# Altium schematic sheet BufferDriver.SchDoc
size A4; DocumentNumber: 3; SheetNumber: 3; SheetTotal: 6
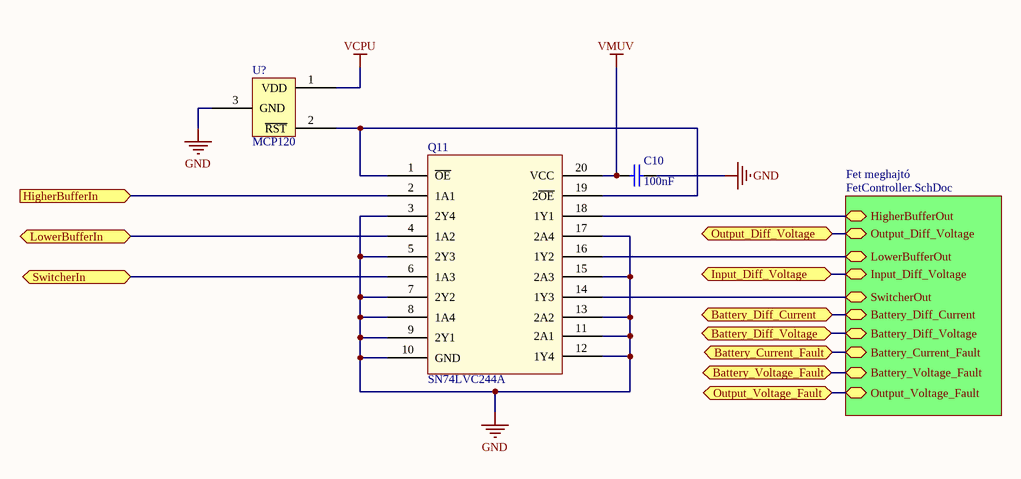
[diagram p0: BufferDriver.SchDoc]

## Parts
C10  100nF  [FP_0805_CAP_085]
Q11  SN74LVC244A  [SOP20]
U?  MCP120  [SOT-23 - 3]

## Sub-sheets
Fet meghajtó = FetController.SchDoc: HigherBufferOut, LowerBufferOut, SwitcherOut, Output_Diff_Voltage, Input_Diff_Voltage, Battery_Diff_Voltage, Battery_Diff_Current, Battery_Current_Fault, Battery_Voltage_Fault, Output_Voltage_Fault

## Ports
Battery_Current_Fault, Battery_Diff_Current, Battery_Diff_Voltage, Battery_Voltage_Fault, HigherBufferIn (in), Input_Diff_Voltage, LowerBufferIn (bidir), Output_Diff_Voltage, Output_Voltage_Fault, SwitcherIn

## Nets
GND: C10.1 Q11.3(2Y4) Q11.5(2Y3) Q11.7(2Y2) Q11.8(1A4) Q11.9(2Y1) Q11.10(GND) Q11.11(2A1) Q11.12(1Y4) Q11.13(2A2) Q11.15(2A3) Q11.17(2A4) U?.3(GND)
VCPU: U?.1(VDD)
VMUV: C10.2 Q11.20(VCC)
Battery_Current_Fault: port Battery_Current_Fault, sheet Fet meghajtó/Battery_Current_Fault
Battery_Diff_Current: port Battery_Diff_Current, sheet Fet meghajtó/Battery_Diff_Current
Battery_Diff_Voltage: port Battery_Diff_Voltage, sheet Fet meghajtó/Battery_Diff_Voltage
Battery_Voltage_Fault: port Battery_Voltage_Fault, sheet Fet meghajtó/Battery_Voltage_Fault
HigherBufferIn: Q11.2(1A1) ; port HigherBufferIn
Input_Diff_Voltage: port Input_Diff_Voltage, sheet Fet meghajtó/Input_Diff_Voltage
LowerBufferIn: Q11.4(1A2) ; port LowerBufferIn
Output_Diff_Voltage: port Output_Diff_Voltage, sheet Fet meghajtó/Output_Diff_Voltage
Output_Voltage_Fault: port Output_Voltage_Fault, sheet Fet meghajtó/Output_Voltage_Fault
SwitcherIn: Q11.6(1A3) ; port SwitcherIn
NetQ11_1: Q11.1(~{OE}) Q11.19(2~{OE}) U?.2(~{RST})
NetQ11_14: Q11.14(1Y3) ; sheet Fet meghajtó/SwitcherOut
NetQ11_16: Q11.16(1Y2) ; sheet Fet meghajtó/LowerBufferOut
NetQ11_18: Q11.18(1Y1) ; sheet Fet meghajtó/HigherBufferOut

## Library data of the parts
C10 = CAP: Capacitor; Value: 100nF; Lomex NR: 82-07-32
U? = MCP120: Voltage detector